# EAGLE schematic VeroAttempt1 (EAGLE 6.5.0)
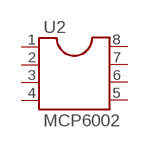
[diagram p0: schematic, sheet 1]

## Parts
U2  MCP6002  DIL8S  [SOCKET-08]
Unconnected: U2.1 U2.2 U2.3 U2.4 U2.5 U2.6 U2.7 U2.8

## Library data of the parts
U2 = ic-package:DIL8: Dual In Line / Socket